# EAGLE schematic magnetorquer_board (EAGLE 7.5.0)
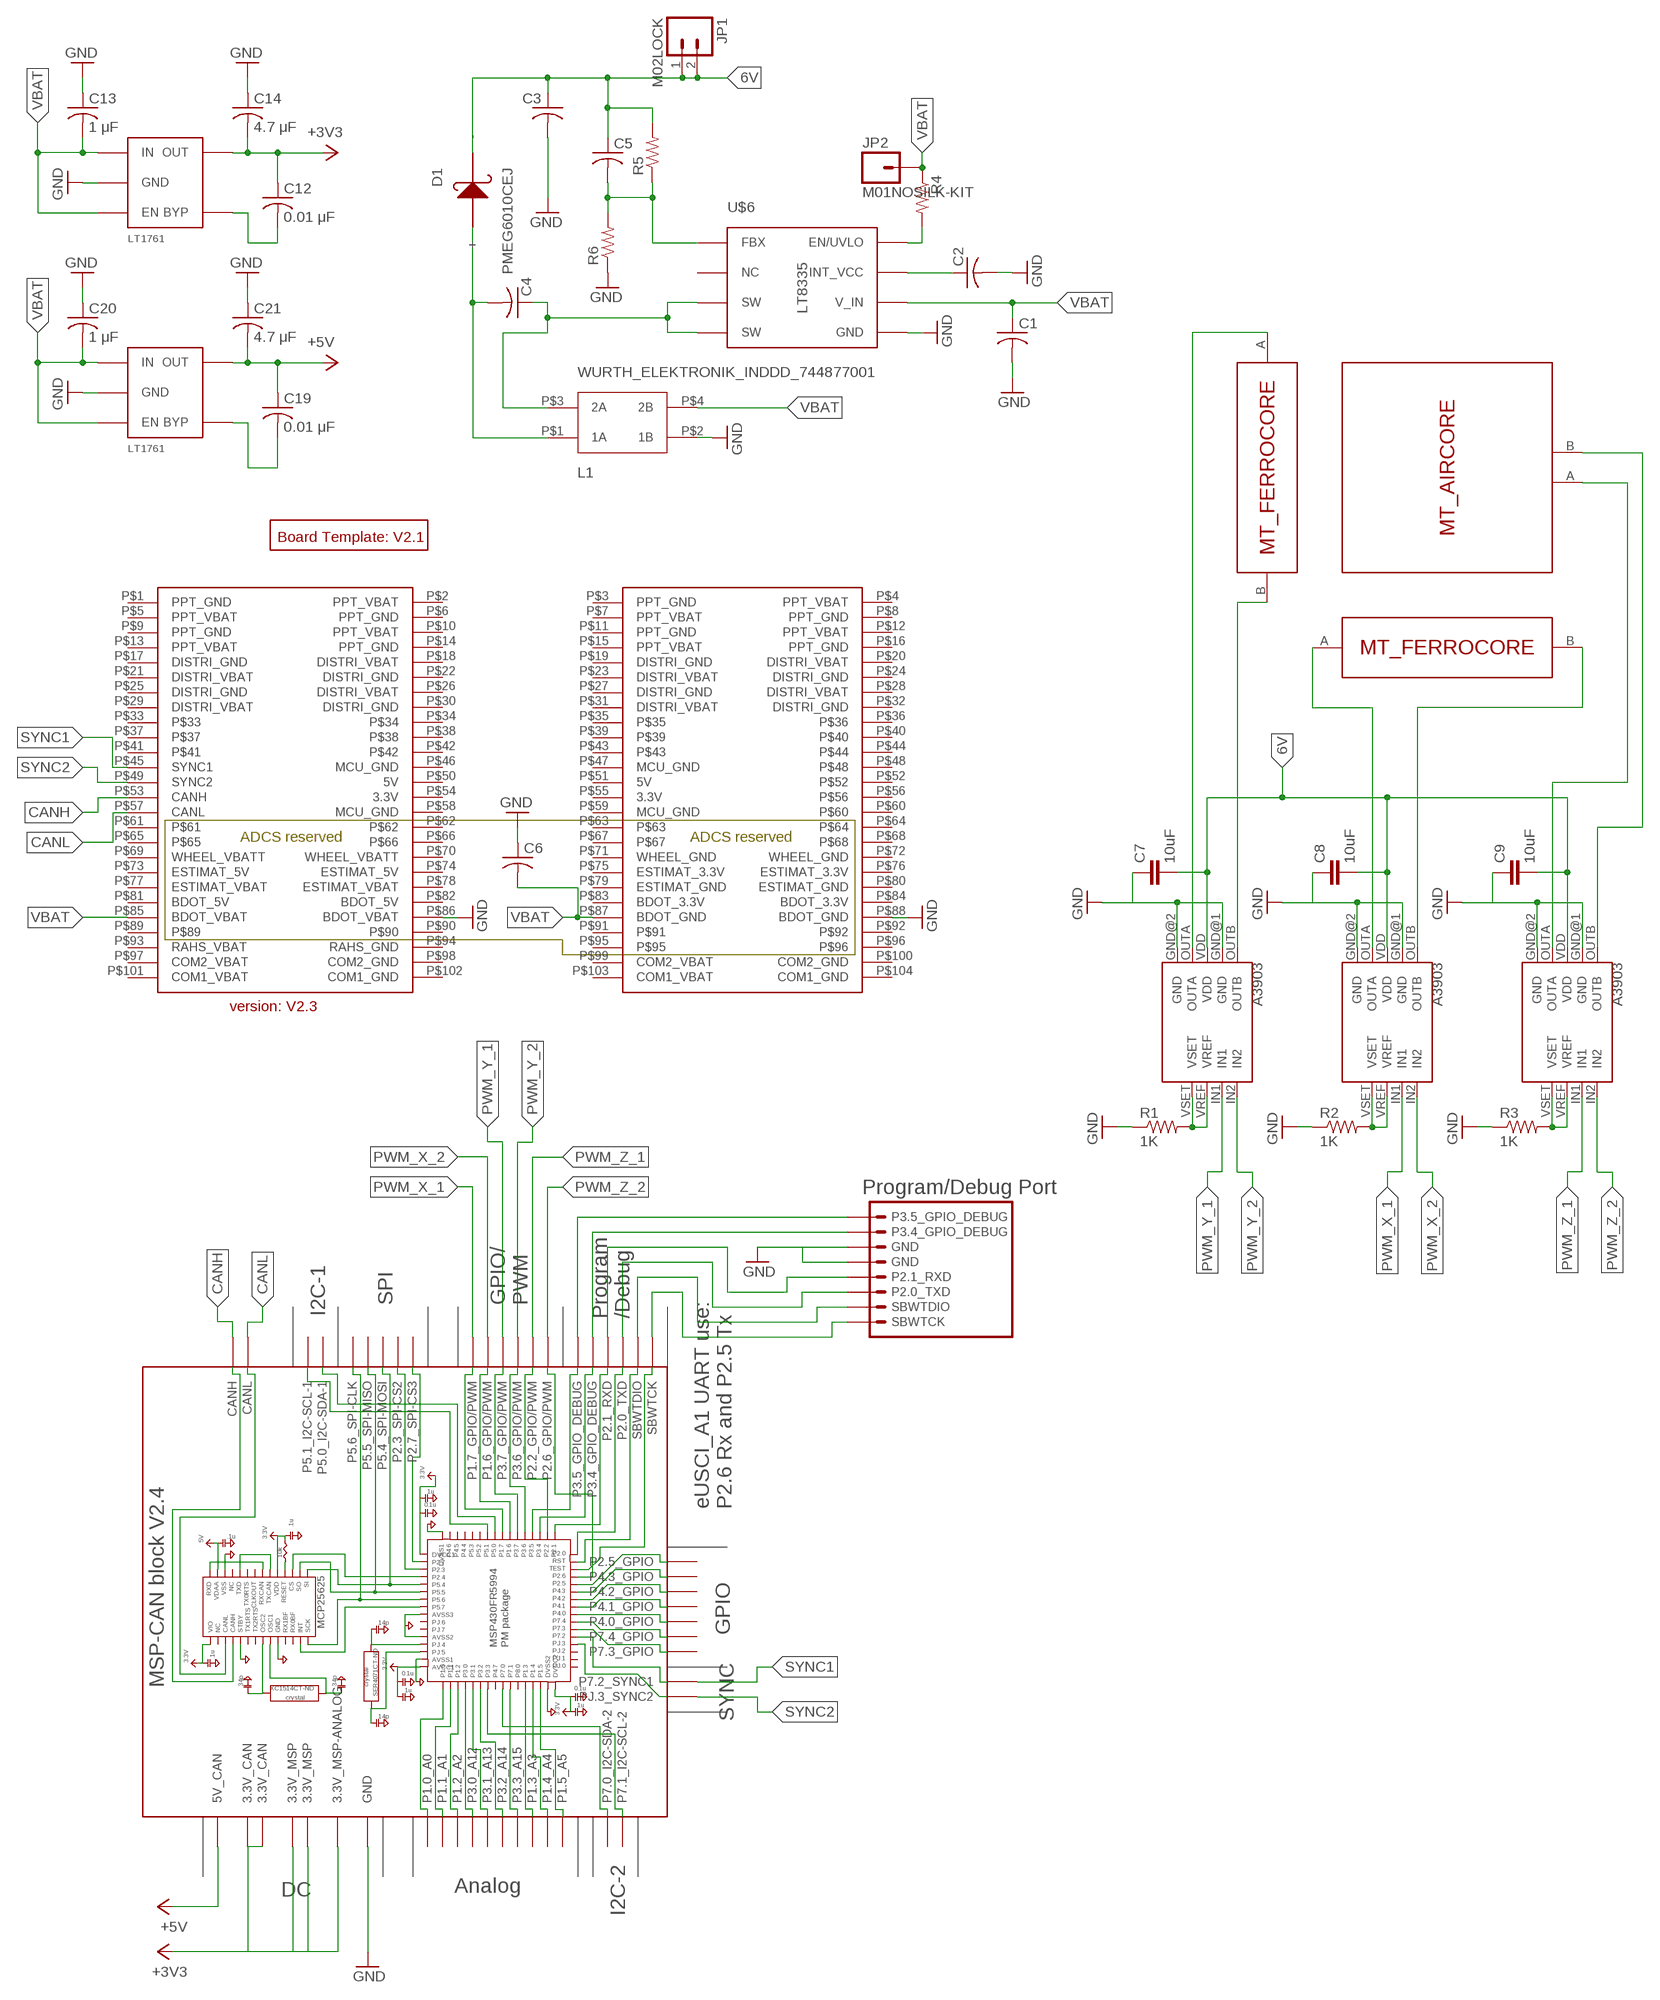
[diagram p0: schematic, sheet 1]

## Parts
C1  C-USC0805  [C0805]
C2  C-USC0805  [C0805]
C3  C-USC0805  [C0805]
C4  C-USC0805  [C0805]
C5  C-USC0805  [C0805]
C6  C-USC0805  [C0805]
C7  10uF  C-EUC0805  [C0805]
C8  10uF  C-EUC0805  [C0805]
C9  10uF  C-EUC0805  [C0805]
C12  0.01 μF  C-USC0805  [C0805]
C13  1 μF  C-USC0805  [C0805]
C14  4.7 μF  C-USC0805  [C0805]
C19  0.01 μF  C-USC0805  [C0805]
C20  1 μF  C-USC0805  [C0805]
C21  4.7 μF  C-USC0805  [C0805]
D1  PMEG6010CEJ  [SC-90]
JP1  M02LOCK  [1X02_LOCK]
JP2  M01NOSILK-KIT  [1X01NS-KIT]
L1  WURTH_ELEKTRONIK_INDDD_744877001  [WURTH_ELEKTRONIK_INDDD_744877001]
LDO_3V1  LINEAR_LDO_LT1761-X  [SOT-23-5]
LDO_5V1  LINEAR_LDO_LT1761-X  [SOT-23-5]
R1  1K  R-US_R0603  [R0603]
R2  1K  R-US_R0603  [R0603]
R3  1K  R-US_R0603  [R0603]
R4  R-US_R0805  [R0805]
R5  R-US_R0805  [R0805]
R6  R-US_R0805  [R0805]
U1  A3903  [DFN-8EE]
U2  A3903  [DFN-8EE]
U3  A3903  [DFN-8EE]
U$1  PC104_CONNECTOR  [PC104_CONNECTOR]
U$2  BOARD_TEMPLATE1  [BOARD_TEMPLATE]
U$3  MT_AIRCORE  [MT_AIRCORE]
U$4  MT_FERROCORE  [MT_FERROCORE]
U$5  MT_FERROCORE  [MT_FERROCORE]
U$6  LT8335  [DDB]
U$7  MSP-CAN_BLOCK  [MSP-CAN_BLOCK]
U$8  PROGRAM/DEBUG_PORT  [1X08_CONNECTOR]

## Nets
6V: C3.1 C5.1 C7.2 C8.2 C9.2 D1.P$2(-) JP1.1 JP1.2 R5.2 U1.VDD U2.VDD U3.VDD
+3V3: C12.1 C14.2 LDO_3V1.P$5(OUT) U$7.3.3V@CAN1(3.3V_CAN) U$7.3.3V@CAN2(3.3V_CAN) U$7.3.3V@MSP1(3.3V_MSP) U$7.3.3V@MSP2(3.3V_MSP) U$7.3.3V_ANALOG@MSP2(3.3V_MSP-ANALOG)
+5V: C19.1 C21.2 LDO_5V1.P$5(OUT) U$7.5V(5V_CAN)
CANH: U$1.P$53(CANH) U$7.CANH
CANL: U$1.P$57(CANL) U$7.CANL
EN_UVLO: R4.2 U$6.P$8(EN/UVLO)
FBX: C5.2 R5.1 R6.2 U$6.P$1(FBX)
GND: C1.2 C2.2 C3.2 C6.1 C7.1 C8.1 C9.1 C13.1 C14.1 C20.1 C21.1 L1.P$2(1B) LDO_3V1.P$2(GND) LDO_5V1.P$2(GND) R1.1 R2.1 R3.1 R6.1 U1.GND@1(GND) U1.GND@2(GND) U2.GND@1(GND) U2.GND@2(GND) U3.GND@1(GND) U3.GND@2(GND) U$1.P$86(BDOT_VBAT) U$1.P$88(BDOT_GND) U$6.GND U$6.P$5(GND) U$7.GND@1(GND) U$7.GND@2(GND) U$7.GND@3(GND) U$7.GND@4(GND) U$7.GND@5(GND) U$7.GND@7(GND) U$7.GND@8(GND) U$7.GND@9(GND) U$7.GND@10(GND) U$7.GND@11(GND) U$7.GND@12(GND) U$7.GND@13(GND) U$7.GND@14(GND) U$7.GND@15(GND) U$7.GND@16(GND) U$7.GND@17(GND) U$7.GND@26(GND) U$8.5(GND) U$8.6(GND)
INT_VCC: C2.1 U$6.P$7(INT_VCC)
N$1: R1.2 U1.VREF U1.VSET
N$2: R2.2 U2.VREF U2.VSET
N$4: C12.2 LDO_3V1.P$4(BYP)
N$6: C4.2 D1.P$1(+) L1.P$1(1A)
N$7: R3.2 U3.VREF U3.VSET
N$8: C19.2 LDO_5V1.P$4(BYP)
N$10: U1.OUTB U$4.B
N$11: U1.OUTA U$4.A
N$12: U2.OUTA U$5.A
N$13: U2.OUTB U$5.B
N$14: U3.OUTB U$3.B
N$15: U3.OUTA U$3.A
N$27: U$7.SBWTCK U$8.SBWTCK
N$28: U$7.SBWTDIO U$8.2(SBWTDIO)
N$29: U$7.P2.0_TXD U$8.3(P2.0_TXD)
N$30: U$7.P2.1_RXD U$8.4(P2.1_RXD)
N$31: U$7.P3.4_GPIO_DEBUG U$8.7(P3.4_GPIO_DEBUG)
N$32: U$7.P3.5_GPIO_DEBUG U$8.8(P3.5_GPIO_DEBUG)
PWM_X_1: U2.IN1 U$7.P1.7_GPIO/PWM
PWM_X_2: U2.IN2 U$7.P1.6_GPIO/PWM
PWM_Y_1: U1.IN1 U$7.P3.7_GPIO/PWM
PWM_Y_2: U1.IN2 U$7.P3.6_GPIO/PWM
PWM_Z_1: U3.IN1 U$7.P2.2_GPIO/PWM
PWM_Z_2: U3.IN2 U$7.P2.6_GPIO/PWM
SW: C4.1 L1.P$3(2A) U$6.P$3(SW) U$6.P$4(SW)
SYNC1: U$1.P$45(SYNC1) U$7.P7.2_SYNC1
SYNC2: U$1.P$49(SYNC2) U$7.PJ.3_SYNC2
VBAT: C1.1 C6.2 C13.2 C20.2 JP2.1 L1.P$4(2B) LDO_3V1.P$1(IN) LDO_3V1.P$3(EN) LDO_5V1.P$1(IN) LDO_5V1.P$3(EN) R4.1 U$1.P$85(BDOT_VBAT) U$1.P$87(BDOT_GND) U$6.P$6(V_IN)
Unconnected: U$1.P$1(PPT_GND) U$1.P$2(PPT_VBAT) U$1.P$3(PPT_GND) U$1.P$4(PPT_VBAT) U$1.P$5(PPT_VBAT) U$1.P$6(PPT_GND) U$1.P$7(PPT_VBAT) U$1.P$8(PPT_GND) U$1.P$9(PPT_GND) U$1.P$10(PPT_VBAT) U$1.P$11(PPT_GND) U$1.P$12(PPT_VBAT) U$1.P$13(PPT_VBAT) U$1.P$14(PPT_GND) U$1.P$15(PPT_VBAT) U$1.P$16(PPT_GND) U$1.P$17(DISTRI_GND) U$1.P$18(DISTRI_VBAT) U$1.P$19(DISTRI_GND) U$1.P$20(DISTRI_VBAT) U$1.P$21(DISTRI_VBAT) U$1.P$22(DISTRI_GND) U$1.P$23(DISTRI_VBAT) U$1.P$24(DISTRI_GND) U$1.P$25(DISTRI_GND) U$1.P$26(DISTRI_VBAT) U$1.P$27(DISTRI_GND) U$1.P$28(DISTRI_VBAT) U$1.P$29(DISTRI_VBAT) U$1.P$30(DISTRI_GND) U$1.P$31(DISTRI_VBAT) U$1.P$32(DISTRI_GND) U$1.P$33 U$1.P$34 U$1.P$35 U$1.P$36 U$1.P$37 U$1.P$38 U$1.P$39 U$1.P$40 U$1.P$41 U$1.P$42 U$1.P$43 U$1.P$44 U$1.P$46(MCU_GND) U$1.P$47(MCU_GND) U$1.P$48 U$1.P$50(5V) U$1.P$51(5V) U$1.P$52 U$1.P$54(3.3V) U$1.P$55(3.3V) U$1.P$56 U$1.P$58(MCU_GND) U$1.P$59(MCU_GND) U$1.P$60 U$1.P$61 U$1.P$62 U$1.P$63 U$1.P$64 U$1.P$65 U$1.P$66 U$1.P$67 U$1.P$68 U$1.P$69(WHEEL_VBATT) U$1.P$70(WHEEL_VBATT) U$1.P$71(WHEEL_GND) U$1.P$72(WHEEL_GND) U$1.P$73(ESTIMAT_5V) U$1.P$74(ESTIMAT_5V) U$1.P$75(ESTIMAT_3.3V) U$1.P$76(ESTIMAT_3.3V) U$1.P$77(ESTIMAT_VBAT) U$1.P$78(ESTIMAT_VBAT) U$1.P$79(ESTIMAT_GND) U$1.P$80(ESTIMAT_GND) U$1.P$81(BDOT_5V) U$1.P$82(BDOT_5V) U$1.P$83(BDOT_3.3V) U$1.P$84(BDOT_3.3V) U$1.P$89 U$1.P$90 U$1.P$91 U$1.P$92 U$1.P$93(RAHS_VBAT) U$1.P$94(RAHS_GND) U$1.P$95 U$1.P$96 U$1.P$97(COM2_VBAT) U$1.P$98(COM2_GND) U$1.P$99(COM2_VBAT) U$1.P$100(COM2_GND) U$1.P$101(COM1_VBAT) U$1.P$102(COM1_GND) U$1.P$103(COM1_VBAT) U$1.P$104(COM1_GND) U$6.P$2(NC) U$7.P1.0_A0 U$7.P1.1_A1 U$7.P1.2_A2 U$7.P1.3_A3 U$7.P1.4_A4 U$7.P1.5_A5 U$7.P2.4_SPI-CS2(P2.3_SPI-CS2) U$7.P2.5_GPIO U$7.P2.7_SPI-CS3 U$7.P3.0_A12 U$7.P3.1_A13 U$7.P3.2_A14 U$7.P3.3_A15 U$7.P4.0_GPIO U$7.P4.1_GPIO U$7.P4.2_GPIO U$7.P4.3_GPIO U$7.P5.0_I2C-SDA-1 U$7.P5.1_I2C-SCL-1 U$7.P5.4_SPI-MOSI U$7.P5.5_SPI-MISO U$7.P5.6_SPI-CLK U$7.P7.0_I2C-SDA-2 U$7.P7.1_I2C-SCL-2 U$7.P7.3_GPIO U$7.P7.4_GPIO

## Library data of the parts
C1-C6 C12-C14 C19-C21 = rcl:C-US: CAPACITOR, American symbol
C7-C9 = rcl:C-EU: CAPACITOR, European symbol
D1 = DubSat1 Components:PMEG6010CEJ
JP1 = SparkFun-Connectors:M02: Standard 2-pin 0.1" header. Use with - straight break away headers ( PRT-00116) - right angle break away headers (PRT-00553) - swiss pins (PRT-00743) - machine pins (PRT-00117) - female headers (PRT-00115) Molex polarized connector foot print use with: PRT-08233 with associated crimp pins and housings. 2.54_SCREWTERM for use with PRT-10571. 3.5mm Screw Terminal footprints for PRT-08084 5mm Screw Terminal footprints for use with PRT-08432
JP2 = SparkFun-Connectors:M01: Header 1 Standard 1-pin 0.1" header. Use with straight break away headers (SKU : PRT-00116), right angle break away headers (PRT-00553), swiss pins (PRT-00743), machine pins (PRT-00117), and female headers (PRT-00115).
L1 = DubSat1 Components:WURTH_ELEKTRONIK_INDDD_744877001
LDO_3V1 LDO_5V1 = DubSat1 Components:LINEAR_LDO_LT1761-X
R1-R6 = rcl:R-US_: RESISTOR, American symbol
U1-U3 = DubSat1 Components:A3903: Allegro MicroSystems A3903 H-bridge Technical Specifications: Supply voltage: 3-5.5V Operating temperature: -40°C to 85°C Output current: 500mA Digikey: 620-1205-1-ND
U$1 = DubSat1 Components:PC104_CONNECTOR
U$2 = DubSat1 Components:BOARD_TEMPLATE
U$3 = DubSat1 Components:MT_AIRCORE
U$4 U$5 = DubSat1 Components:MT_FERROCORE
U$6 = DubSat1 Components:LT8335
U$7 = DubSat1 Components:MSP-CAN_BLOCK
U$8 = DubSat1 Components:PROGRAM/DEBUG_PORT

## Net classes
0 default: width 0.254 mm, drill 0.254 mm, clearance 0.152 mm